# EAGLE design drv (EAGLE 7.2.0)
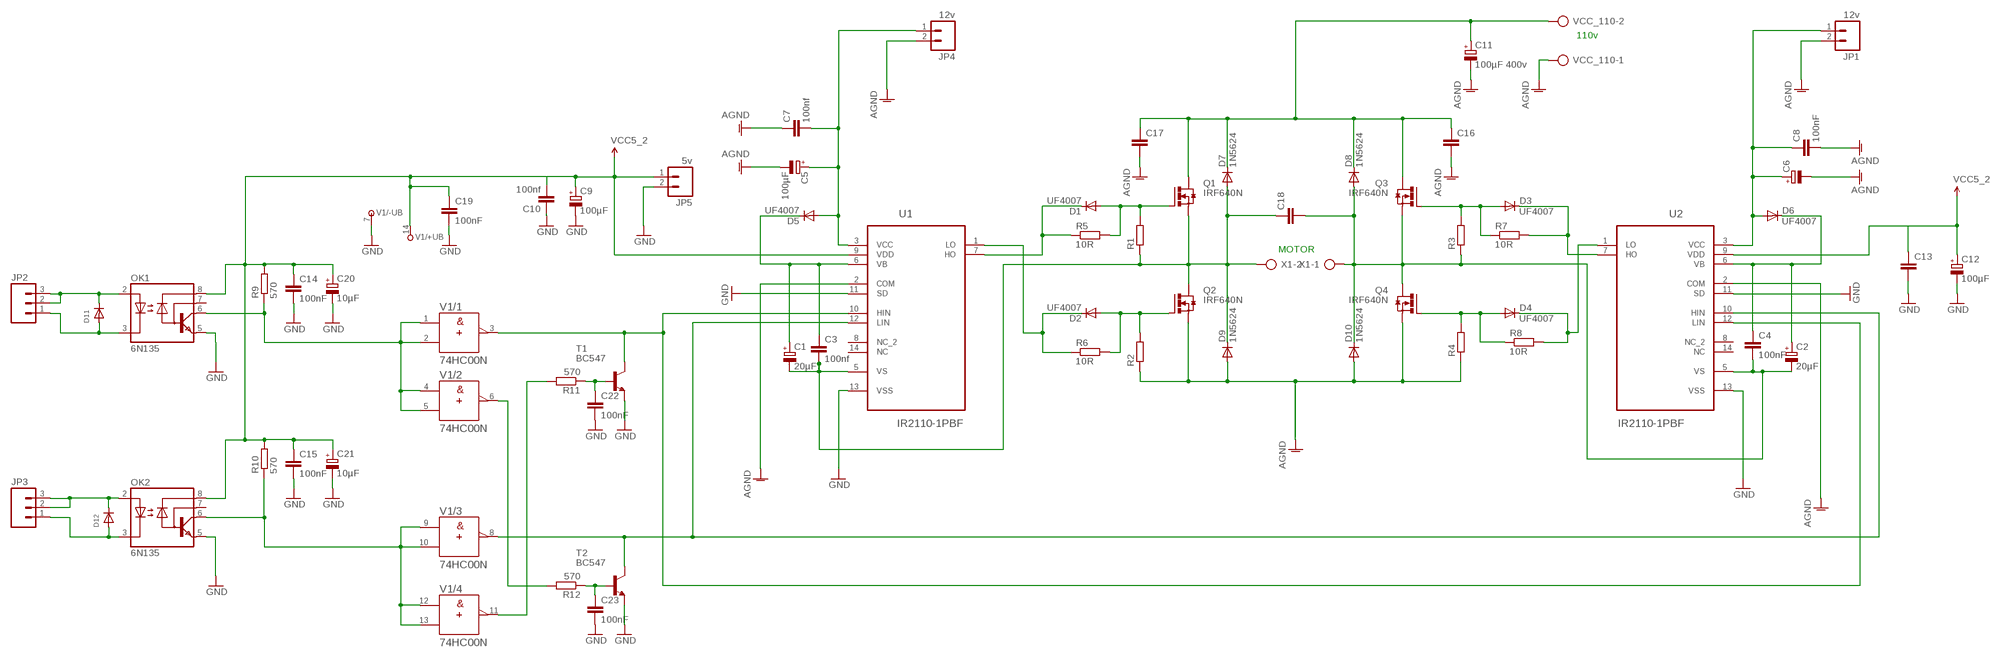
[diagram p0: schematic, sheet 1]

## Parts
C1  20µF  CPOL-EUE2,5-6E  [E2,5-6E]
C2  20µF  CPOL-EUE2,5-6E  [E2,5-6E]
C3  100nf  C-EUC0805  [C0805]
C4  100nF  C-EUC0504  [C0504]
C5  100µF  CPOL-EUE2-5  [E2-5]
C6  CPOL-EUE2-5  [E2-5]
C7  100nf  C-EUC1310  [C1310]
C8  100nF  C-EUC0805  [C0805]
C9  100µF  CPOL-EUE2-5  [E2-5]
C10  100nf  C-EUC0805  [C0805]
C11  100µF 400v  CPOL-EUE10-25  [EB25D]
C12  100µF  CPOL-EUE2-5  [E2-5]
C13  C-EUC0805  [C0805]
C14  100nF  C-EUC0805  [C0805]
C15  100nF  C-EUC0805  [C0805]
C16  C5/3  [C5B3]
C17  C5/3  [C5B3]
C18  C-EU150-091X182  [C150-091X182]
C19  100nF  C-EUC0805  [C0805]
C20  10µF  CPOL-EUE2-5  [E2-5]
C21  10µF  CPOL-EUE2-5  [E2-5]
C22  100nF  C-EUC0805  [C0805]
C23  100nF  C-EUC0805  [C0805]
D1  UF4007  DIODE  [DIODE-1N4001-KIT]
D2  UF4007  DIODE  [DIODE-1N4001-KIT]
D3  UF4007  DIODE  [DIODE-1N4001-KIT]
D4  UF4007  DIODE  [DIODE-1N4001-KIT]
D5  UF4007  DIODE  [DIODE-1N4001-KIT]
D6  UF4007  DIODE  [DIODE-1N4001-KIT]
D7  1N5624  [DO201-15]
D8  1N5624  [DO201-15]
D9  1N5624  [DO201-15]
D10  1N5624  [DO201-15]
D11  DIODEDO-1N4148  [DO-1N4148]
D12  DIODEDO-1N4148  [DO-1N4148]
JP1  12v  M02JST-PTH-VERT  [JST-2-PTH-VERT]
JP2  M03LOCK  [1X03_LOCK]
JP3  M03LOCK  [1X03_LOCK]
JP4  12v  M02JST-PTH-VERT  [JST-2-PTH-VERT]
JP5  5v  M02JST-PTH-VERT  [JST-2-PTH-VERT]
OK1  6N135  [DIL08]
OK2  6N135  [DIL08]
Q1  IRF640N  IRF3704L-V  [TO262-V]
Q2  IRF640N  IRF3704L-V  [TO262-V]
Q3  IRF640N  IRF3704L-V  [TO262-V]
Q4  IRF640N  IRF3704L-V  [TO262-V]
R1  R-EU_0207/12  [0207/12]
R2  R-EU_0207/12  [0207/12]
R3  R-EU_0207/12  [0207/12]
R4  R-EU_0207/12  [0207/12]
R5  10R  R-EU_0207/12  [0207/12]
R6  10R  R-EU_0207/12  [0207/12]
R7  10R  R-EU_0207/12  [0207/12]
R8  10R  R-EU_0207/12  [0207/12]
R9  570  R-EU_R0805  [R0805]
R10  570  R-EU_R0805  [R0805]
R11  570  R-EU_R0805  [R0805]
R12  570  R-EU_R0805  [R0805]
T1  BC547  [TO92]
T2  BC547  [TO92]
U1  IR2110-1PBF  [DIP254P762X533-14]
U2  IR2110-1PBF  [DIP254P762X533-14]
V1  74HC00N  [DIL14]
VCC_110  AK300/2  [AK300/2]
X1  AK300/2  [AK300/2]

## Nets
AGND: C5.- C6.- C7.1 C8.2 C11.- C16.2 C17.2 D9.A D10.A JP1.2 JP4.2 Q2.3(S) Q4.3(S) R2.1 R4.1 U1.2(COM) U2.2(COM) VCC_110.1
GND: C9.- C10.1 C12.- C13.2 C14.2 C15.2 C19.2 C20.- C21.- C22.2 C23.2 JP5.2 T1.1(E) T2.1(E) U1.11(SD) U1.13(VSS) U2.11(SD) U2.13(VSS) V1.7(/-UB:-UB)
N$1: D1.A Q1.1(G) R1.2 R5.2
N$2: OK1.5(GND)
N$3: D11.C JP2.2 JP2.3 OK1.2(A)
N$4: D2.A Q2.1(G) R2.2 R6.2
N$5: D1.C R5.1 U1.7(HO)
N$6: D11.A JP2.1 OK1.3(C)
N$7: D2.C R6.1 U1.1(LO)
N$8: OK2.6(VO) R10.1 V1.9(/3:A) V1.10(/3:B) V1.12(/4:A) V1.13(/4:B)
N$9: D3.A Q3.1(G) R3.2 R7.1
N$10: D3.C R7.2 U2.7(HO)
N$11: D4.C R8.2 U2.1(LO)
N$12: D12.A JP3.1 OK2.3(C)
N$13: OK1.6(VO) R9.1 V1.1(/1:A) V1.2(/1:B) V1.4(/2:A) V1.5(/2:B)
N$14: D4.A Q4.1(G) R4.2 R8.1
N$15: C1.+ C3.1 D5.C U1.6(VB)
N$16: T1.3(C) U1.10(HIN) U2.12(LIN) V1.3(/1:Y)
N$17: C2.+ C4.1 D6.C U2.6(VB)
N$18: OK2.5(GND)
N$19: T2.3(C) U1.12(LIN) U2.10(HIN) V1.8(/3:Y)
N$20: R11.2 V1.11(/4:Y)
N$22: C22.1 R11.1 T1.2(B)
N$23: C23.1 R12.1 T2.2(B)
N$24: R12.2 V1.6(/2:Y)
N$26: D12.C JP3.2 JP3.3 OK2.2(A)
OUT1: C2.- C4.2 C18.2 D8.A D10.C Q3.3(S) Q4.2(D) R3.1 U2.5(VS) X1.1
OUT2: C1.- C3.2 C18.1 D7.A D9.C Q1.3(S) Q2.2(D) R1.1 U1.5(VS) X1.2
VCC: C9.+ C10.2 C12.+ C13.1 C14.1 C15.1 C19.1 C20.+ C21.+ JP5.1 OK1.8(VCC) OK2.8(VCC) R9.2 R10.2 U1.9(VDD) U2.9(VDD) V1.14(/+UB:+UB) ; supply symbol labelled VCC5_2
VCC_12_1: C5.+ C7.2 D5.A JP4.1 U1.3(VCC)
VCC_12_2: C6.+ C8.1 D6.A JP1.1 U2.3(VCC)
VCC_110: C11.+ C16.1 C17.1 D7.C D8.C Q1.2(D) Q3.2(D) VCC_110.2
Unconnected: OK1.7(VB) OK2.7(VB) U1.8(NC_2) U1.14(NC) U2.8(NC_2) U2.14(NC)

## Notes on the sheet
- 110v
- MOTOR

## Library data of the parts
C1 C2 C5 C6 C9 C11 C12 C20 C21 = rcl:CPOL-EU: POLARIZED CAPACITOR, European symbol
C3 C4 C7 C8 C10 C13-C15 C19 C22 C23 = rcl:C-EU: CAPACITOR, European symbol
C16 C17 = capacitor-wima:C: CAPACITOR naming: grid - package width
C18 = resistor:C-EU: CAPACITOR, European symbol
D1-D6 = SparkFun-DiscreteSemi:DIODE: Diode
D7-D10 = diode:1N5624: DIODE controlled avalanche rectifier
D11 D12 = adafruit:DIODE: Diode
JP1 JP4 JP5 = SparkFun-Connectors:M02: Standard 2-pin 0.1" header. Use with - straight break away headers ( PRT-00116) - right angle break away headers (PRT-00553) - swiss pins (PRT-00743) - machine pins (PRT-00117) - female headers (PRT-00115) Molex polarized connector foot print use with: PRT-08233 with associated crimp pins and housings. 2.54_SCREWTERM for use with PRT-10571. 3.5mm Screw Terminal footprints for PRT-08084 5mm Screw Terminal footprints for use with PRT-08433
JP2 JP3 = SparkFun-Connectors:M03: Header 3 Standard 3-pin 0.1" header. Use with straight break away headers (SKU : PRT-00116), right angle break away headers (PRT-00553), swiss pins (PRT-00743), machine pins (PRT-00117), and female headers (PRT-00115). Molex polarized connector foot print use with SKU : PRT-08232 with associated crimp pins and housings.
OK1 OK2 = optocoupler:6N135: MOTOROLA OPTO COUPLER; MF: FAIRCHILD SEMICONDUCTOR; MPN: 6N135; OC_FARNELL: 1021342; OC_NEWARK: 58K9658
Q1-Q4 = transistor-power:IRF3704: SMPS MOSFET HEXFET® Power MOSFET Source: http://www.irf.com/product-info/datasheets/data/irf3704.pdf
R1-R12 = rcl:R-EU_: RESISTOR, European symbol
T1 T2 = transistor:BC547: NPN TRANSISTOR
U1 U2 = International_Rectifier_By_element14_Batch_1:IR2110-1PBF: HIGH AND LOW SIDE DRIVER; MPN: IR2110-1PBF; OC_FARNELL: 1374799; OC_NEWARK: 19K8414; PACKAGE: PDIP-14; SUPPLIER: INTERNATIONAL RECTIFIER
V1 = 74ttl-din:74*00: Quad 2-input NAND gate
VCC_110 X1 = con-ptr500:AK300/2: CONNECTOR; OC_FARNELL: unknown; OC_NEWARK: unknown

## Board
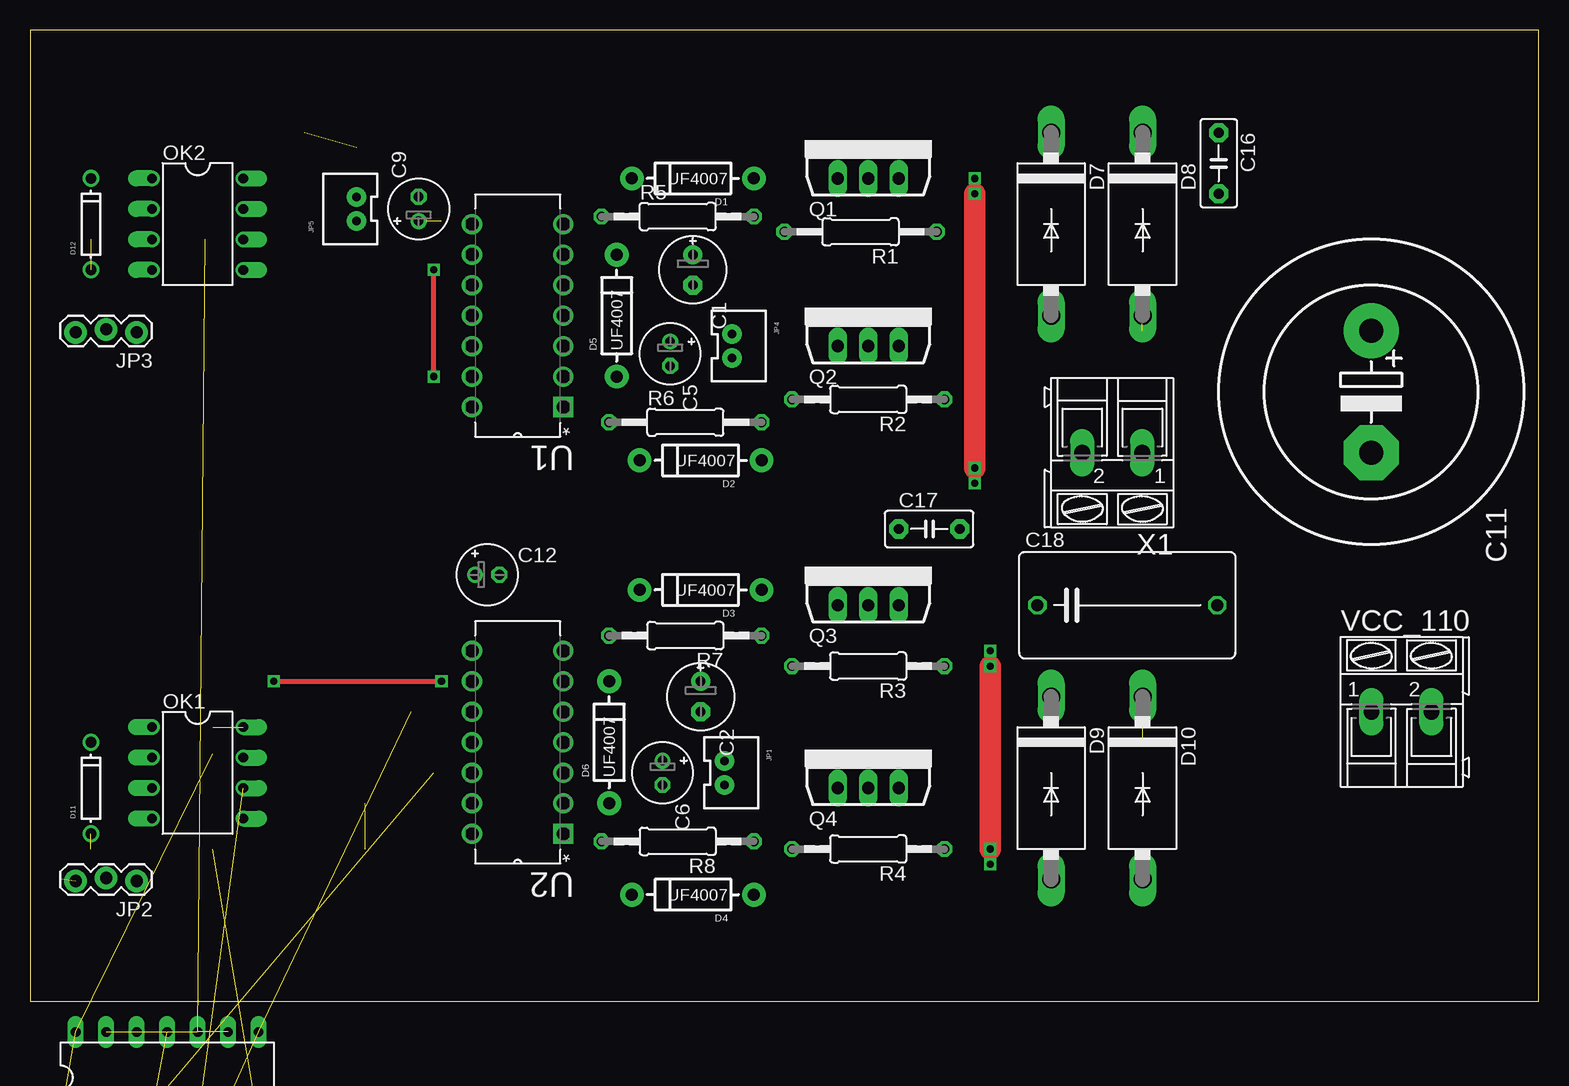
[diagram p1: board, top side]
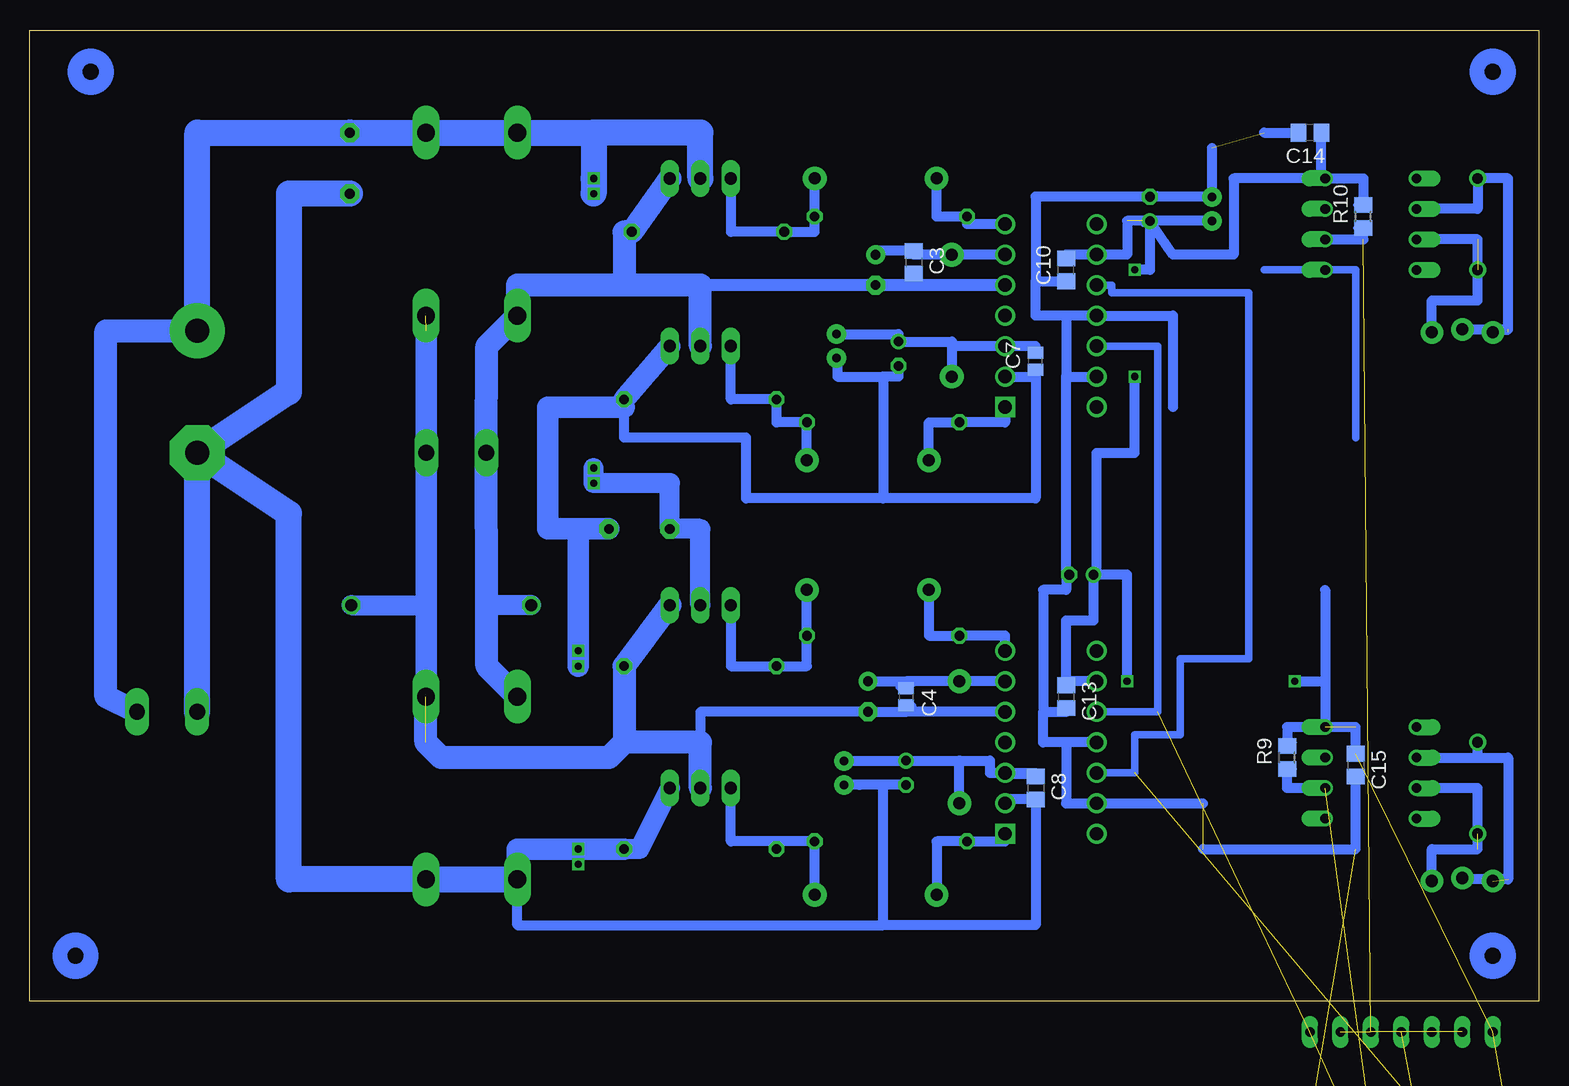
[diagram p2: board, bottom side, seen from below]

Size 125.71 x 80.95 mm. Coordinates in mm from the lower left corner, seen from the top.
Outline: 0,0 125.71,0 125.71,80.95 0,80.95 0,0
Copper layers (1*16): Top 0.035mm / dielectric 1.5mm / Bottom 0.035mm
Design rules "default": minimum track width 10mil, minimum drill 24mil, track to track 8mil, track to pad 8mil, pad to pad 8mil, via to via 8mil, smd to smd 8mil, copper to edge 40mil, drill to drill 8mil, minimum pad ring 10mil, minimum via ring 8mil, stop-mask expansion 4mil, vias tented up to drill 0mil, thermal gap 10mil

### Footprints (pad centres in the part's own frame; a part is rotated, then mirrored left to right if it is on the bottom)
E2,5-6E = drill 0.813 pad 1.575: + -1.27,0 | drill 0.813 pad 1.575 octagon: - 1.27,0
C0805 = smd 1.3 x 1.5: 1 -0.95,0; 2 0.95,0
C0504 = smd 1 x 1.3: 1 -0.7,0; 2 0.7,0
E2-5 = drill 0.813 pad 1.27: + -1.016,0 | drill 0.813 pad 1.27 octagon: - 1.016,0
C1310 = smd 1 x 1.3: 1 -0.7,0; 2 0.7,0
EB25D = drill 2.007 pad 4.597: + -5.08,0 | drill 2.007 pad 4.597 octagon: - 5.08,0
C5B3 = drill 0.813 pad 1.6 octagon: 1 -2.54,0; 2 2.54,0
C150-091X182 = drill 1.016 octagon: 1 -7.493,0; 2 7.493,0
DIODE-1N4001-KIT = drill 1 pad 1.981: A -5.08,0; C 5.08,0
DO201-15 = drill 1.499 long: A 7.62,0; C -7.62,0
DO-1N4148 = drill 0.9: A -3.81,0; C 3.81,0
JST-2-PTH-VERT = drill 0.7 pad 1.626: 1 -1,-0.55; 2 1,-0.55
1X03_LOCK = drill 1.016 pad 1.88: 1 0,0.127; 2 2.54,-0.127; 3 5.08,0.127
DIL08 = drill 0.813 offset: 1 -3.81,-3.81; 2 -1.27,-3.81; 3 1.27,-3.81; 4 3.81,-3.81; 5 3.81,3.81; 6 1.27,3.81; 7 -1.27,3.81; 8 -3.81,3.81
TO262-V = drill 1.016 long: 1 -2.54,0; 2 0,0; 3 2.54,0
0207/12 = drill 0.813 octagon: 1 -6.35,0; 2 6.35,0
R0805 = smd 1.3 x 1.5: 1 -0.95,0; 2 0.95,0
TO92 = drill 0.813 octagon: 1 1.27,0; 2 0,1.905; 3 -1.27,0
DIP254P762X533-14 = drill 1.118 square: 1 -7.62,15.24 | drill 1.118: 2 -7.62,12.7; 3 -7.62,10.16; 4 -7.62,7.62; 5 -7.62,5.08; 6 -7.62,2.54; 7 -7.62,0; 8 0,0; 9 0,2.54; 10 0,5.08; 11 0,7.62; 12 0,10.16; 13 0,12.7; 14 0,15.24
DIL14 = drill 0.813 long: 1 -7.62,-3.81; 2 -5.08,-3.81; 3 -2.54,-3.81; 4 0,-3.81; 5 2.54,-3.81; 6 5.08,-3.81; 7 7.62,-3.81; 8 7.62,3.81; 9 5.08,3.81; 10 2.54,3.81; 11 0,3.81; 12 -2.54,3.81; 13 -5.08,3.81; 14 -7.62,3.81
AK300/2 = drill 1.321 long: 1 -2.515,0; 2 2.489,0

### Placement (x,y rotation side)
C1  55.24,60.96 270 top
C2  55.88,25.4 270 top
C3  52.07,61.6 270 bottom
C4  52.7,25.4 270 bottom
C5  53.34,53.98 270 top
C6  52.7,19.05 270 top
C7  41.91,53.34 90 bottom
C8  41.91,17.78 270 bottom
C9  32.38,66.04 90 top
C10  39.37,60.96 90 bottom
C11  111.76,50.8 270 top
C12  38.1,35.56 0 top
C13  39.37,25.4 270 bottom
C14  19.05,72.39 180 bottom
C15  15.24,19.68 270 bottom
C16  99.06,69.85 270 top
C17  74.93,39.37 0 top
C18  91.44,33.02 0 top
C19  2.54,-15.24 0 top  (outside the outline)
C20  3.81,-21.59 0 top  (outside the outline)
C21  3.81,-27.94 0 top  (outside the outline)
C22  2.54,-57.15 0 top  (outside the outline)
C23  2.54,-63.5 0 top  (outside the outline)
D1  55.24,68.58 180 top
D2  55.88,45.09 180 top
D3  55.88,34.29 180 top
D4  55.24,8.89 180 top
D5  48.9,57.15 90 top
D6  48.26,21.59 90 top
D7  85.09,64.77 270 top
D8  92.71,64.77 270 top
D9  85.09,17.78 270 top
D10  92.71,17.78 270 top
D11  5.08,17.78 90 top
D12  5.08,64.77 90 top
JP1  58.42,19.05 270 top
JP2  8.89,10.16 180 top
JP3  8.89,55.88 180 top
JP4  59.05,54.61 270 top
JP5  26.67,66.04 90 top
OK1  13.97,19.05 270 top
OK2  13.97,64.77 270 top
Q1  69.85,68.58 0 top
Q2  69.85,54.61 0 top
Q3  69.85,33.02 0 top
Q4  69.85,17.78 0 top
R1  69.22,64.13 180 top
R2  69.85,50.16 180 top
R3  69.85,27.94 180 top
R4  69.85,12.7 180 top
R5  53.98,65.41 0 top
R6  54.61,48.26 0 top
R7  54.61,30.48 180 top
R8  53.98,13.34 180 top
R9  20.95,20.32 90 bottom
R10  14.61,65.41 90 bottom
R11  2.54,-44.45 0 top  (outside the outline)
R12  2.54,-50.8 0 top  (outside the outline)
T1  3.81,-34.29 0 top  (outside the outline)
T2  3.81,-39.37 0 top  (outside the outline)
U1  36.83,64.77 180 top
U2  36.83,29.21 180 top
V1  11.43,-6.35 0 top
VCC_110  114.3,24.13 0 top
X1  90.17,45.72 180 top

### Tracks (layer width: path | path; a pad name or v marks a point on that pad's centre or on a via)
AGND  (via drill 0.6)
  Top 1.778: v80.01,27.94 v80.01,12.7
  Bottom 0.406: C7.1 41.91,52.07
  Bottom 0.813: 54.61,41.91 41.91,41.91 41.91,52.07 U1.2 | 54.61,41.91 66.04,41.91 66.04,46.99 76.2,46.99 76.2,49.53 R2.1 | JP4.2 58.42,53.61 58.42,52.07 54.61,52.07 | C5.- 53.34,52.07 54.61,52.07 | 54.61,52.07 54.61,41.91 | C6.- 54.61,18.03 | 54.61,18.03 56.6,18.03 JP1.2 | 54.61,6.35 41.91,6.35 C8.2 44.45,16.83 U2.2 | 54.61,6.35 54.61,18.03 | 54.61,6.35 85.09,6.35 D9.A
  Bottom 1.676: Q4.3 74.93,12.7 R4.1
  Bottom 1.778: Q2.3 R2.1 | R4.1 v80.01,12.7 85.09,12.7 D9.A | 80.01,39.37 v80.01,29.21 v80.01,27.94 | C17.2 80.01,39.37 | 80.01,39.37 82.55,39.37 82.55,49.53 76.2,49.53
  Bottom 2.184: VCC_110.1 C11.- | C16.2 104.14,67.31 104.14,50.8 C11.- | C11.- 104.14,40.64 104.14,10.16 D10.A D9.A
GND  (10 unrouted)
  Bottom 0.406: C9.- 32.38,67.31 31.75,67.31
  Bottom 0.813: 22.86,72.39 C14.2 | 27.22,71.12 JP5.2 32.38,67.04 C9.- 41.91,67.06 41.91,60.01 | 41.91,60.01 C10.1 | 39.37,57.15 U1.11 30.48,57.15 30.48,49.53 | 39.37,57.15 39.37,52.07 | 39.37,52.07 U1.13 | 39.37,35.56 39.37,52.07 | C12.- 39.37,35.56 | 39.37,35.56 39.37,34.29 41.27,34.29 41.27,24.13 | 41.27,24.13 39.37,24.13 C13.2 | U2.11 39.37,21.59 | 39.37,21.59 39.37,16.51 U2.13 27.94,16.51 | 39.37,21.59 41.27,21.59 41.27,24.13 | 39.37,57.15 41.91,57.15 41.91,60.01 | 27.94,12.7 15.24,12.7 C15.2
N$1
  Bottom 0.813: Q1.1 67.31,64.13 R1.2 60.33,64.13 R5.2 D1.A
N$3  (1 unrouted)
  Bottom 0.406: 3.81,10.29 JP2.3
  Bottom 0.813: OK1.2 5.08,20.32 | 5.08,20.32 D11.C | 5.08,20.32 2.54,20.32 2.54,10.16 6.35,10.16 JP2.2
N$4
  Bottom 0.406: R2.2 63.5,49.53
  Bottom 0.813: D2.A R6.2 63.5,48.26 63.5,49.53 | R2.2 67.31,50.16 Q2.1
N$5
  Bottom 0.813: U1.7 47.62,64.77 R5.1 50.16,65.41 D1.C
N$6  (1 unrouted)
  Bottom 0.813: JP2.1 8.89,12.7 5.08,12.7 5.08,17.78 OK1.3
N$7
  Bottom 0.813: U1.1 44.45,48.26 R6.1 50.8,48.26 D2.C
N$8  (4 unrouted)
  Bottom 0.406: R10.1 15.24,64.46
  Bottom 0.813: OK2.6 14.61,63.5 R10.1
N$9
  Bottom 0.813: D3.A R7.1 60.96,27.94 R3.2 67.31,27.94 Q3.1
N$10
  Bottom 0.813: D3.C 50.8,30.48 R7.2 44.45,30.48 U2.7
N$11
  Bottom 0.813: U2.1 44.45,13.34 R8.2 50.16,13.34 D4.C
N$12  (1 unrouted)
  Bottom 0.813: JP3.1 8.89,58.42 5.08,58.42 5.08,63.5 OK2.3
N$13  (4 unrouted)
  Bottom 0.406: R9.1 20.32,19.37
  Bottom 0.813: OK1.6 20.95,17.78 R9.1
N$14
  Bottom 0.813: D4.A R8.1 63.5,13.34 | 63.5,13.34 R4.2 | 63.5,13.34 67.31,13.34 Q4.1
N$15
  Bottom 0.813: U1.6 D5.C 52.07,62.23 C3.1 55.24,62.54 C1.+
N$16  (2 unrouted)
  Bottom 0.61: U1.10 35.56,59.69 35.56,59.05 24.13,59.05 24.13,44.45 24.13,28.57 29.84,28.57 29.84,22.23 33.66,22.23 33.66,19.05 U2.12
N$17
  Bottom 0.406: C4.1 53.34,26.1 53.34,26.67
  Bottom 0.813: U2.6 D6.C 52.07,26.67 52.7,26.67 | 52.7,26.67 C4.1 | C2.+ 52.7,26.67
N$18
  Bottom 0.61: 22.86,60.96 OK2.5 15.24,60.96 15.24,46.99
N$19  (2 unrouted)
  Bottom 0.61: U1.12 31.75,54.61 31.75,36.83 31.75,24.13 U2.10
N$20  (1 unrouted)
N$22  (2 unrouted)
N$23  (2 unrouted)
N$24  (1 unrouted)
N$26  (1 unrouted)
  Bottom 0.406: 3.81,56.01 JP3.3 2.54,55.75
  Bottom 0.813: JP3.2 2.54,56.01 2.54,68.58 D12.C 5.08,66.04 OK2.2
N$27  (via drill 0.6)
  other vias: 80.01,11.43
OUT1  (2 unrouted)
  Bottom 0.406: 92.71,40.64 X1.1 | 52.07,24.13 52.7,24.13 C4.2 52.07,24.7 52.07,24.13
  Bottom 0.813: 69.85,21.59 69.85,24.13 C2.- 52.7,24.13 U2.5
  Bottom 1.676: C18.2 92.69,33.02
  Bottom 1.778: 92.69,55.88 X1.1 92.69,33.02 92.69,26.67 D10.C
  Bottom 1.93: Q4.2 69.85,21.59 76.2,21.59 | Q3.3 R3.1 76.2,21.59 | 76.2,21.59 77.47,20.32 91.44,20.32 92.71,21.59 D10.C
OUT2
  Bottom 0.406: C3.2 52.07,59.69
  Bottom 1.016: U1.5 52.07,59.69 C1.- 76.2,59.69
  Bottom 1.676: C18.1 87.64,33.02
  Bottom 1.93: D9.C 87.63,27.94 87.64,33.02 X1.2 87.63,54.61 D7.A 85.09,59.69 76.2,59.69 | Q1.3 R1.1 76.2,64.13 76.2,59.69 | Q2.2 69.85,59.69 76.2,59.69
VCC  (via drill 0.6)  (6 unrouted)
  Top 0.406: v33.66,52.07 v33.66,60.96 | v20.32,26.67 v34.29,26.67
  Bottom 0.406: 39.37,26.67 C13.1 | C9.+ 32.38,64.77 33.02,64.77 33.02,65.04 | R10.2 15.24,66.35 | 20.32,21.59 20.95,21.59 R9.2 | C14.1 17.78,72.39
  Bottom 0.813: OK2.8 18.1,68.58 C14.1 | OK2.8 14.61,68.58 R10.2 | OK2.8 25.4,68.58 25.4,62.23 30.48,62.23 C9.+ 32.38,60.96 v33.66,60.96 | 27.22,64.77 JP5.1 34.29,65.04 34.29,62.23 U1.9 39.37,62.23 C10.2 | v34.29,26.67 34.29,35.56 36.83,35.56 | 36.83,35.56 C12.+ 37.08,31.75 39.37,31.75 39.37,26.67 U2.9 | 36.83,35.56 36.83,45.72 33.66,45.72 v33.66,52.07 | v20.32,26.67 17.78,26.67 | 17.78,26.67 OK1.8 | 17.78,34.29 17.78,26.67 | C15.1 15.24,22.86 20.95,22.86 R9.2
VCC_12_1
  Bottom 0.813: JP4.1 53.34,55.61 C5.+ 48.9,54.99 48.9,54.61 | 48.9,54.61 D5.A | C7.2 41.91,54.61 U1.3 48.9,54.61
VCC_12_2
  Bottom 0.406: C8.1 44.45,18.73 U2.3
  Bottom 0.813: JP1.1 52.7,20.05 C6.+ 48.26,20.07 | 48.26,20.07 45.72,20.07 45.72,19.05 U2.3 41.91,19.05 | D6.A 48.26,20.07
VCC_110  (via drill 0.6)
  Top 1.778: v78.74,67.31 v78.74,44.45
  Bottom 0.813: VCC_110.2 116.84,24.13
  Bottom 1.676: Q3.2 69.85,39.37 C17.1 72.39,43.18 v78.74,43.18 v78.74,44.45
  Bottom 1.93: 116.84,24.13 119.38,25.4 119.38,55.88 C11.+
  Bottom 2.184: C11.+ 111.76,72.39 C16.1 D8.C D7.C 78.74,72.39 | 78.74,72.39 v78.74,68.58 v78.74,67.31 | Q1.2 69.85,72.39 78.74,72.39
(copper drawn outside any net)
  shapes: Bottom circle x4